# Altium schematic sheet 03_01_MCU_ESP32_Interface.SchDoc
size A4; SheetNumber: 4; SheetTotal: 9
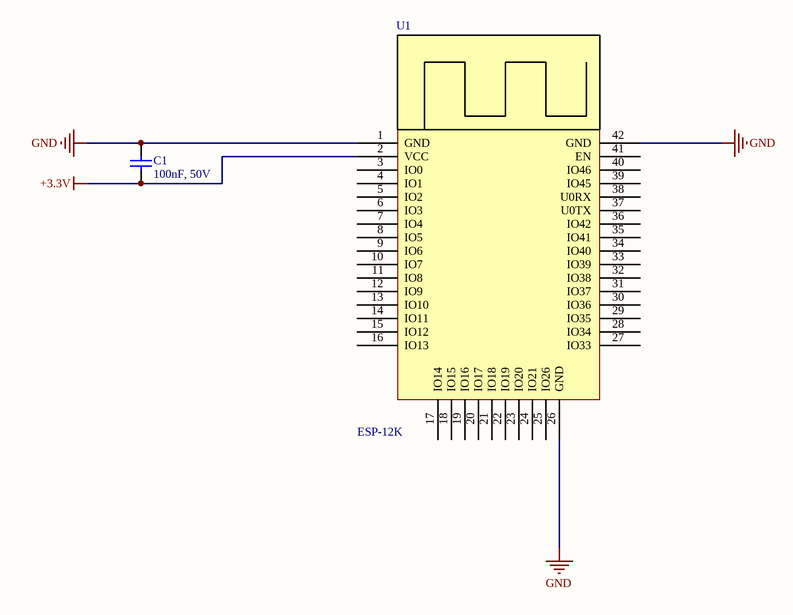
[diagram p0: 03_01_MCU_ESP32_Interface.SchDoc]

## Parts
C1  100nF, 50V  [WCAP-CSGP_0603_H=0.8mm_Reflow]
U1  ESP-12K  [CAC-150P3100X1800-41N]

## Nets
+3.3V: C1.1 U1.2(VCC)
GND: C1.2 U1.1(GND) U1.26(GND) U1.42(GND)

Not connected (* = marked no-connect by the designer): U1 3(IO0) 4(IO1) 5(IO2) 6(IO3) 7(IO4) 8(IO5) 9(IO6) 10(IO7) 11(IO8) 12(IO9) 13(IO10) 14(IO11) 15(IO12) 16(IO13) 17(IO14) 18(IO15) 19(IO16) 20(IO17) 21(IO18) 22(IO19) 23(IO20) 24(IO21) 25(IO26) 27(IO33) 28(IO34) 29(IO35) 30(IO36) 31(IO37) 32(IO38) 33(IO39) 34(IO40) 35(IO41) 36(IO42) 37(U0TX) 38(U0RX) 39(IO45) 40(IO46) 41(EN)

## Library data of the parts
C1 = 885012206095: WCAP-CSGP Multilayer Ceramic Chip Capacitor, General Purpose, size 0603, X7R, 100nF, 50V; Manufacturer: Wurth Elektronik; Rated Voltage: 50VDC; Isolation Resistance: >=5GOhm; Capacitance Tolerance: +/-10%; Technical Reference: X7R0603104K050DFCT10000; ComponentLink1Description: Manufacturer; ComponentLink1URL: http://www.we-online.de; ComponentLink2Description: Datasheet; ComponentLink2URL: https://www.we-online.com/catalog/datasheet/885012206095.pdf; Operating Temperature: -55 to +125degC; Packaging: Tape and Reel; Manufacturer Part Number: 885012206095; Published Date: May 2020; Ceramic Type: X7R; Dissipation Factor: =<3%; Height: 0.8mm; Mounting Technology: SMT; Size: 0603; Capacitance: 100nF
U1 = ESP-12K: ESP32-S2